# EAGLE design Ardumouse-LiION_rev3 (EAGLE 7.6.0)
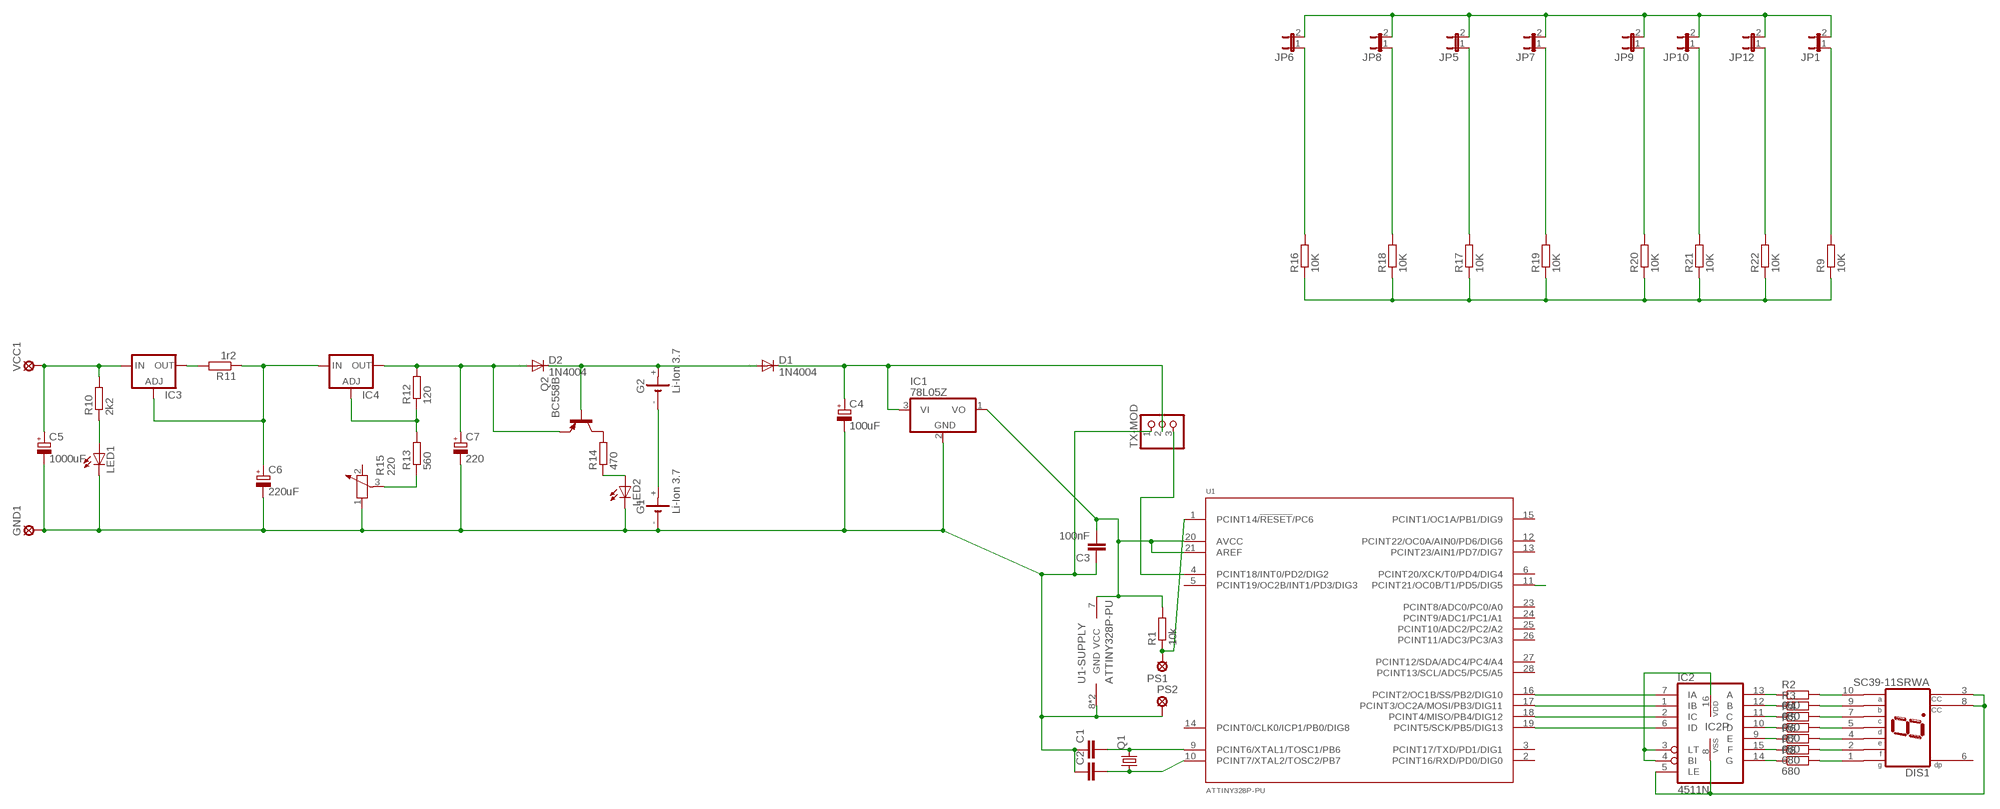
[diagram p0: schematic, sheet 1]

## Parts
C1  C2,5-3  [C2.5-3]
C2  C2,5-3  [C2.5-3]
C3  100nF  C2,5-3  [C2.5-3]
C4  100uF  CPOL-EUE3.5-8  [E3,5-8]
C5  1000uF  CPOL-EUE3.5-8  [E3,5-8]
C6  220uF  CPOL-EUE3.5-8  [E3,5-8]
C7  220  CPOL-EUE3.5-8  [E3,5-8]
D1  1N4004  [DO41-10]
D2  1N4004  [DO41-10]
DIS1  SC39-11SRWA  [HDSP-E]
G1  Li-Ion 3.7  SL-160AA/PR  [SL-160AA/PR]
G2  Li-Ion 3.7  SL-160AA/PR  [SL-160AA/PR]
GND1  LSP13  [LSP13]
IC1  78L05Z  [TO92]
IC2  4511N  [DIL16]
IC3  LM317TS  [317TS]
IC4  LM317TS  [317TS]
JP1  JP1E  [JP1]
JP5  JP1E  [JP1]
JP6  JP1E  [JP1]
JP7  JP1E  [JP1]
JP8  JP1E  [JP1]
JP9  JP1E  [JP1]
JP10  JP1E  [JP1]
JP12  JP1E  [JP1]
LED1  LED5MM  [LED5MM]
LED2  LED5MM  [LED5MM]
PS1  LSP10  [LSP10]
PS2  LSP10  [LSP10]
Q1  CRYSTALHC49S  [HC49/S]
Q2  BC558B  [TO92-EBC]
R1  10k  R-EU_0204/7  [0204/7]
R2  680  R-EU_0204/7  [0204/7]
R3  680  R-EU_0204/7  [0204/7]
R4  680  R-EU_0204/7  [0204/7]
R5  680  R-EU_0204/7  [0204/7]
R6  680  R-EU_0204/7  [0204/7]
R7  680  R-EU_0204/7  [0204/7]
R8  680  R-EU_0204/7  [0204/7]
R9  10K  R-EU_0204/7  [0204/7]
R10  2k2  R-EU_0207/7  [0207/7]
R11  1r2  R-EU_0207/7  [0207/7]
R12  120  R-EU_0207/7  [0207/7]
R13  560  R-EU_0207/7  [0207/7]
R14  470  R-EU_0207/7  [0207/7]
R15  220  POTENTIOMETER_PT-10  [PT-10]
R16  10K  R-EU_0204/7  [0204/7]
R17  10K  R-EU_0204/7  [0204/7]
R18  10K  R-EU_0204/7  [0204/7]
R19  10K  R-EU_0204/7  [0204/7]
R20  10K  R-EU_0204/7  [0204/7]
R21  10K  R-EU_0204/7  [0204/7]
R22  10K  R-EU_0204/7  [0204/7]
TX-MOD  PINHD-1X3  [1X03]
U1  ATTINY328P-PU  [DIP-28]
VCC1  LSP13  [LSP13]

## Nets
DISA: C3.2 IC1.1(VO) R1.2 U1.7(VCC) U1.20(AVCC) U1.21(AREF)
N$1: C1.2 Q1.2 U1.9(PCINT6/XTAL1/TOSC1/PB6)
N$2: C2.2 Q1.1 U1.10(PCINT7/XTAL2/TOSC2/PB7)
N$4: C4.+ D1.C IC1.3(VI) TX-MOD.2
N$6: LED1.A R10.1
N$7: TX-MOD.3 U1.4(PCINT18/INT0/PD2/DIG2)
N$10: U1.11(PCINT21/OC0B/T1/PD5/DIG5)
N$15: IC2.13(A) R2.1
N$16: PS1.MP R1.1 U1.1(PCINT14/!RESET!/PC6)
N$17: IC2.7(IA) U1.16(PCINT2/OC1B/SS/PB2/DIG10)
N$18: DIS1.3(CC) DIS1.8(CC) IC2.5(LE) IC2.8(VSS)
N$19: IC2.1(IB) U1.17(PCINT3/OC2A/MOSI/PB3/DIG11)
N$20: IC2.2(IC) U1.18(PCINT4/MISO/PB4/DIG12)
N$21: IC2.12(B) R3.1
N$22: IC2.11(C) R4.1
N$23: IC2.10(D) R5.1
N$24: IC2.9(E) R6.1
N$25: IC2.15(F) R7.1
N$26: IC2.14(G) R8.1
N$27: DIS1.10(A) R2.2
N$28: DIS1.9(B) R3.2
N$29: DIS1.7(C) R4.2
N$30: DIS1.5(D) R5.2
N$31: DIS1.4(E) R6.2
N$32: DIS1.2(F) R7.2
N$33: DIS1.1(G) R8.2
N$34: IC2.6(ID) U1.19(PCINT5/SCK/PB5/DIG13)
N$35: JP1.1 R9.2
N$36: IC2.3(LT) IC2.4(BI) IC2.16(VDD)
N$37: C5.+ IC3.3(IN) R10.2 VCC1.MP
N$39: IC3.2(OUT) R11.2
N$44: C6.+ IC3.1(ADJ) IC4.3(IN) R11.1
N$46: JP6.1 R16.2
N$47: R13.1 R15.3
N$48: IC4.1(ADJ) R12.1 R13.2
N$49: C7.+ D2.A IC4.2(OUT) Q2.E R12.2
N$50: D1.A D2.C G2.+ Q2.B
N$51: Q2.C R14.2
N$52: LED2.A R14.1
N$53: G1.+ G2.-
N$54: JP5.1 R17.2
N$55: JP8.1 R18.2
N$56: JP9.1 R20.2
N$57: JP10.1 R21.2
N$58: JP12.1 R22.2
N$59: R9.1 R16.1 R17.1 R18.1 R19.1 R20.1 R21.1 R22.1
N$60: JP1.2 JP5.2 JP6.2 JP7.2 JP8.2 JP9.2 JP10.2 JP12.2
N$61: JP7.1 R19.2
N$62: C1.1 C2.1 C3.1 C4.- C5.- C6.- C7.- G1.- GND1.MP IC1.2(GND) LED1.K(C) LED2.K(C) PS2.MP R15.1 TX-MOD.1 U1.8(GND) U1.22(GND)
Unconnected: DIS1.6(DP) R15.2 U1.2(PCINT16/RXD/PD0/DIG0) U1.3(PCINT17/TXD/PD1/DIG1) U1.5(PCINT19/OC2B/INT1/PD3/DIG3) U1.6(PCINT20/XCK/T0/PD4/DIG4) U1.12(PCINT22/OC0A/AIN0/PD6/DIG6) U1.13(PCINT23/AIN1/PD7/DIG7) U1.14(PCINT0/CLK0/ICP1/PB0/DIG8) U1.15(PCINT1/OC1A/PB1/DIG9) U1.23(PCINT8/ADC0/PC0/A0) U1.24(PCINT9/ADC1/PC1/A1) U1.25(PCINT10/ADC2/PC2/A2) U1.26(PCINT11/ADC3/PC3/A3) U1.27(PCINT12/SDA/ADC4/PC4/A4) U1.28(PCINT13/SCL/ADC5/PC5/A5)

## Library data of the parts
C1-C3 = capacitor-wima:C: CAPACITOR naming: grid - package width
C4 = resistor:CPOL-EU: POLARIZED CAPACITOR, European symbol
C5-C7 = rcl:CPOL-EU: POLARIZED CAPACITOR, European symbol
D1 D2 = diode:1N4004: DIODE general purpose rectifier, 1 A
DIS1 = display-hp:SC39-11SRWA: SINGLE DIGIT NUMERIC DISPLAY 9.9mm (0.39INCH) Source: SC39-11SRWA.pdf; OC_FARNELL: unknown; OC_NEWARK: unknown
G1 G2 = battery:SL-160AA/PR: LI BATTERY Sonnenschein
GND1 VCC1 = solpad:LSP13: SOLDER PAD drill 1.3 mm, distributor Buerklin, 12H562
IC1 = linear:78*: Positive VOLTAGE REGULATOR Source: http://cache.national.com/ds/LM/LM78L05.pdf http://www.fairchildsemi.com/ds/LM/LM7805.pdf
IC2 = 45xx:4511: BCD to 7-segment LATCH/DECODER/DRIVER
IC3 IC4 = v-reg:LM317TS: VOLTAGE REGULATOR
JP1 JP5-JP10 JP12 = jumper:JP1E: JUMPER
LED1 LED2 = led:LED: LED OSRAM: - CHIPLED LG R971, LG N971, LY N971, LG Q971, LY Q971, LO R971, LY R971 LH N974, LH R974 LS Q976, LO Q976, LY Q976 LO Q996 - Hyper CHIPLED LW Q18S LB Q993, LB Q99A, LB R99A - SideLED LS A670, LO A670, LY A670, LG A670, LP A670 LB A673, LV A673, LT A673, LW A673 LH A674 LY A675 LS A676, LA A676, LO A676, LY A676, LW A676 LS A679, LY A679, LG A679 - Hyper Micro SIDELED® LS Y876, LA Y876, LO Y876, LY Y876 LT Y87S - SmartLED LW L88C, LW L88S LB L89C, LB L89S, LG L890 LS L89K, LO L89K, LY L89K LS L896, LA L896, LO L896, LY L896 - TOPLED LS T670, LO T670, LY T670, LG T670, LP T670 LSG T670, LSP T670, LSY T670, LOP T670, LYG T670 LG T671, LOG T671, LSG T671 LB T673, LV T673, LT T673, LW T673 LH T674 LS T676, LA T676, LO T676, LY T676, LB T676, LH T676, LSB T676, LW T676 LB T67C, LV T67C, LT T67C, LS T67K, LO T67K, LY T67K, LW E67C LS E67B, LA E67B, LO E67B, LY E67B, LB E67C, LV E67C, LT E67C LW T67C LS T679, LY T679, LG T679 LS T770, LO T770, LY T770, LG T770, LP T770 LB T773, LV T773, LT T773, LW T773 LH T774 LS E675, LA E675, LY E675, LS T675 LS T776, LA T776, LO T776, LY T776, LB T776 LHGB T686 LT T68C, LB T68C - Hyper Mini TOPLED® LB M676 - Mini TOPLED Santana® LG M470 LS M47K, LO M47K, LY M47K Source: http://www.osram.convergy.de LUXEON: - LUMILED® LXK2-PW12-R00, LXK2-PW12-S00, LXK2-PW14-U00, LXK2-PW14-V00 LXK2-PM12-R00, LXK2-PM12-S00, LXK2-PM14-U00 LXK2-PE12-Q00, LXK2-PE12-R00, LXK2-PE12-S00, LXK2-PE14-T00, LXK2-PE14-U00 LXK2-PB12-K00, LXK2-PB12-L00, LXK2-PB12-M00, LXK2-PB14-N00, LXK2-PB14-P00, LXK2-PB14-Q00 LXK2-PR12-L00, LXK2-PR12-M00, LXK2-PR14-Q00, LXK2-PR14-R00 LXK2-PD12-Q00, LXK2-PD12-R00, LXK2-PD12-S00 LXK2-PH12-R00, LXK2-PH12-S00 LXK2-PL12-P00, LXK2-PL12-Q00, LXK2-PL12-R00 Source: www.luxeon.com KINGBRIGHT: KA-3528ASYC Source: www.kingbright.com
PS1 PS2 = solpad:LSP10: SOLDER PAD drill 1.0 mm, distributor Buerklin, 12H555
Q1 = crystal:CRYSTAL: CRYSTAL; OC_FARNELL: 1667008; OC_NEWARK: unknown
Q2 = transistor-pnp:BC558*: PNP Transistror
R1-R8 = resistor:R-EU_: RESISTOR, European symbol
R9-R14 R16-R22 = rcl:R-EU_: RESISTOR, European symbol
R15 = rcl:POTENTIOMETER_: Potentiometer
TX-MOD = pinhead:PINHD-1X3: PIN HEADER
U1 = volks73-Atmel:ATTINY*8P-?: ATmeag48A/PA/88A/PA/168A/PA/328/P Atmel 8-bit Microcontroller with 4/8/16/32KBytes In-System Programmable Flash Documentation Datasheet <http://www.atmel.com/images/Atmel-8271-8-bit-AVR-Microcontroller-ATmega48A-48PA-88A-88PA-168A-168PA-328-328P_datasheet_Complete.pdf> Features High Performance, Low Power AVR® 8-Bit Microcontroller Advanced RISC Architecture 131 Powerful Instructions – Most Single Clock Cycle Execution 32 x 8 General Purpose Working Registers Fully Static Operation Up to 20 MIPS Throughput at 20MHz On-chip 2-cycle Multiplier High Endurance Non-volatile Memory Segments 4/8/16/32KBytes of In-System Self Programmable Flash program memory 256/512/512/1KBytes EEPROM 512/1K/1K/2KBytes Internal SRAM Write/Erase Cycles: 10,000 Flash/100,000 EEPROM Data Retention: 20 years at 85oC/100 years at 25oC Optional boot Code Section with Independent Lock Bits In-System Programming by On-chip Boot Program True Read-While-Write Operation Atmel® QTouch® library support Capacitive touch buttons, silders and wheels QTouch and QMatrix® acquisition Up to 64 sense channels Peripheral Features Two 8-bit Timer/Counters with Separate Prescaler and Compare Mode One 16-bit Timer/Counter with Separate Prescaler, Compare Mode, and Capture Mode Real Time Counter with Separate Oscillator Six PWM Channels 8-channel 10-bit ADC in TQFP and QFN/MLF package Temperature Measurement 6-channel 10-bit ADC in PDIP Package Temperature Measurement Programmable Serial USART Master/Slave SPI Serial Interface Byte-oriented 2-wire Serial Interface (Philips I2C compatible) Programmable Watchdog Timer with Separate On-chip Oscillator On-chip Analog Comparator Interrupt and Wake-up on Pin Change Special Microcontroller Features Power-on Reset and Programmable Brown-out Detection Internal Calibrated Oscillator External and Internal Interrupt Sources Six Sleep Modes: Idle, ADC Noise Reduction, Power-save, Power-down, Standby, and Extended Standby I/O and Packages 23 Programmable I/O Lines 28-pin PDIP, 32-lead TQFP, 28-pad QFN/MLF and 32-pad QFN/MLF Operating Voltage: 1.8 - 5.5V Temperature Range: -40oC to 85oC Speed Grade: 0 - 4MHz@1.8 - 5.5V, 0 - 10MHz@2.7 - 5.5.V, 0 - 20MHz @ 4.5 - 5.5V Power Consumption at 1MHz, 1.8V, 25oC Active Mode: 0.2mA Power-down Mode: 0.1μA Power-save Mode: 0.75μA (Including 32kHz RTC); CATEGORY: Integrated Circuits (ICs); CONNECTIVITY: I²C, SPI, UART/USART; CORE_PROCESSOR: AVR; CORE_SIZE: 8-Bit; DATA_CONVERTERS: A/D 6x10b; DESCRIPTION: IC MCU 8BIT 32KB FLASH 28DIP; DOCUMENTATION_LINK: <a href="http://www.atmel.com/images/Atmel-8271-8-bit-AVR-Microcontroller-ATmega48A-48PA-88A-88PA-168A-168PA-328-328P_datasheet_Complete.pdf">Datasheet</a>; DOCUMENTATION_URL: http://www.atmel.com/images/Atmel-8271-8-bit-AVR-Microcontroller-ATmega48A-48PA-88A-88PA-168A-168PA-328-328P_datasheet_Complete.pdf; EEPROM_SIZE: 1K x 8; FAMILY: Embedded - Microcontrollers; MANUFACTURER: Atmel; NUMBER_OF_IO: 23; OPERATING_TEMPERATURE: -40°C ~ 85°C; OSCILLATOR_TYPE: Internal; PACKAGE: 28-DIP (0.300", 7.62mm); PART_NUMBER: ATMEGA328P-PU; PERIPHERALS: Brown-out Detect/Reset, POR, PWM, WDT; PROGRAM_MEMORY_SIZE: 32KB (16K x 16); PROGRAM_MEMORY_TYPE: FLASH; RAM_SIZE: 2K x 8; SERIES: AVR® ATmega; SPEED: 20MHz; SUPPLIER_DEVICE_PACKAGE: 28-PDIP; SUPPLIER_ITEM_LINK: <a href="http://www.digikey.com/product-detail/en/ATMEGA328P-PU/ATMEGA328P-PU-ND/1914589">Details</a>; SUPPLIER_ITEM_NUMBER: ATMEGA328P-PU-ND; SUPPLIER_ITEM_URL: http://www.digikey.com/product-detail/en/ATMEGA328P-PU/ATMEGA328P-PU-ND/1914589; SUPPLIER_LINK: <a href="http://www.digikey.com">Home Page</a>; SUPPLIER_NAME: Digi-Key; SUPPLIER_URL: http://www.digikey.com; VOLTAGE-SUPPLY: 1.8 V ~ 5.5 V

## Board
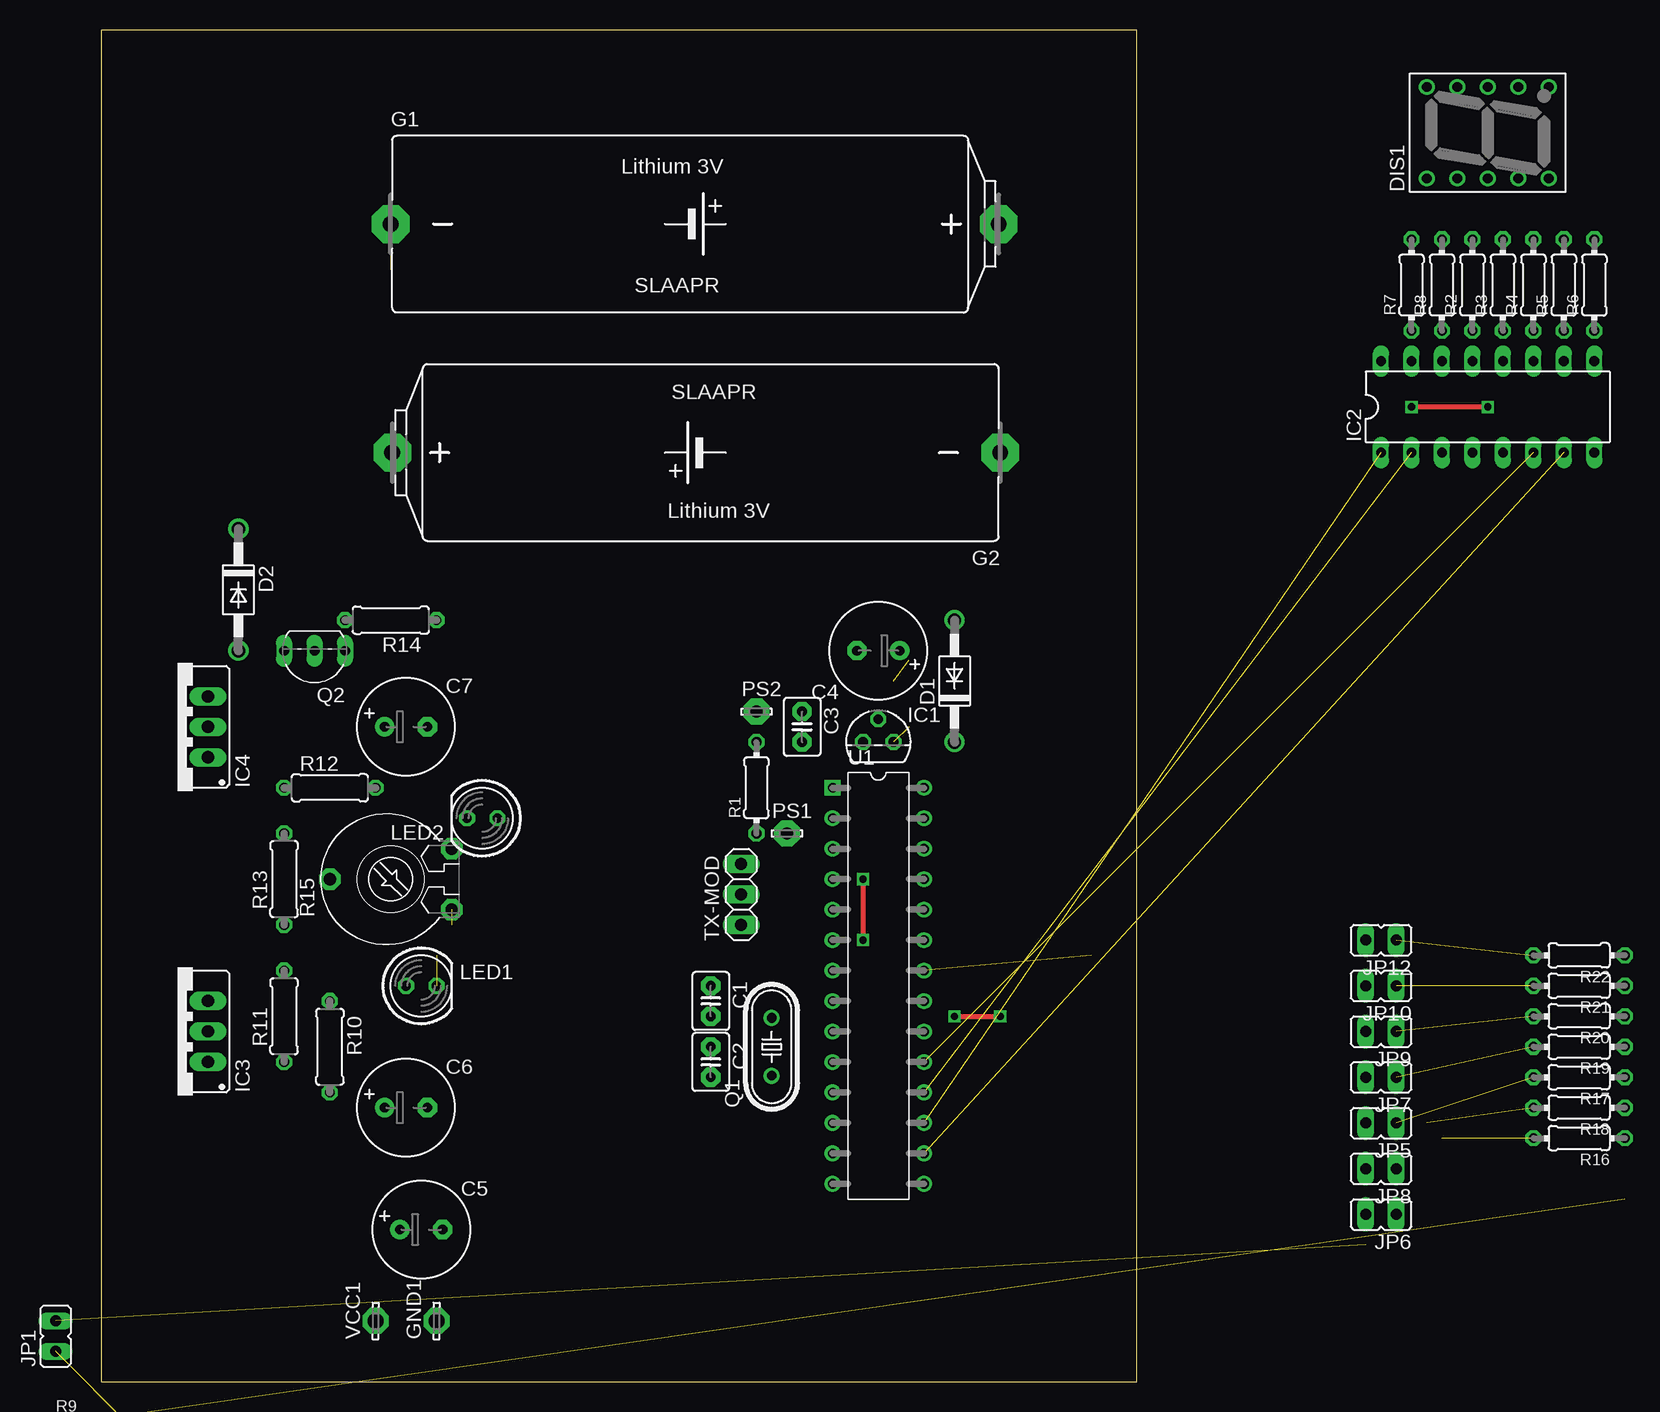
[diagram p1: board, top side]
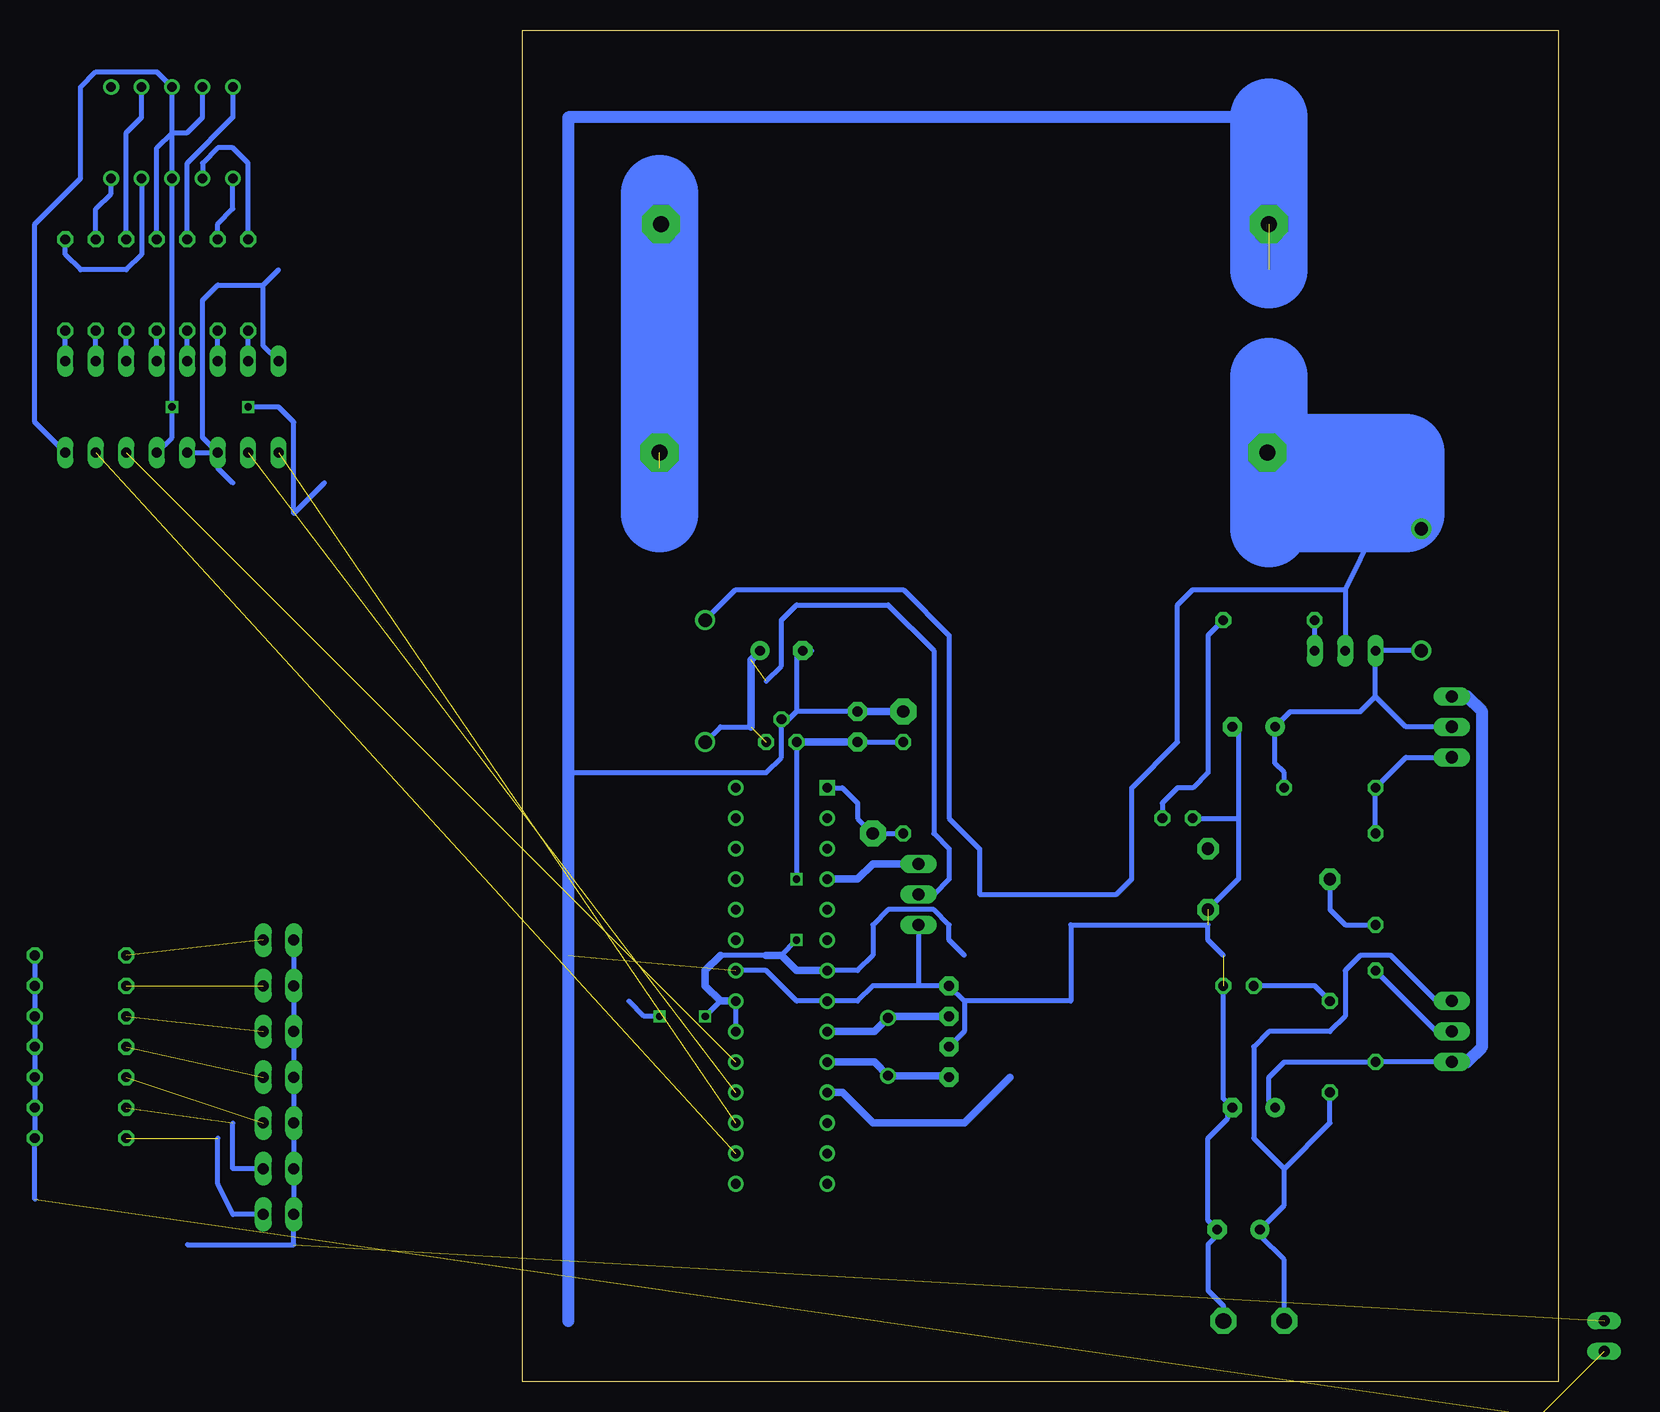
[diagram p2: board, bottom side, seen from below]

Size 86.34 x 112.7 mm. Coordinates in mm from the lower left corner, seen from the top.
Outline: 0,0 86.34,0 86.34,112.7 0,112.7 0,0
Copper layers (1*16): Top 0.035mm / dielectric 1.5mm / Bottom 0.035mm
Design rules "default": minimum track width 10mil, minimum drill 24mil, track to track 8mil, track to pad 8mil, pad to pad 8mil, via to via 8mil, smd to smd 8mil, copper to edge 40mil, drill to drill 8mil, minimum pad ring 10mil, minimum via ring 8mil, stop-mask expansion 4mil, vias tented up to drill 0mil, thermal gap 10mil

### Footprints (pad centres in the part's own frame; a part is rotated, then mirrored left to right if it is on the bottom)
C2.5-3 = drill 0.813 pad 1.6 octagon: 1 -1.27,0; 2 1.27,0
E3,5-8 = drill 0.813 pad 1.6: + -1.778,0 | drill 0.813 pad 1.6 octagon: - 1.778,0
DO41-10 = drill 1.118: A 5.08,0; C -5.08,0
HDSP-E = drill 0.813: 1 -3.81,5.08; 2 -3.81,2.54; 3 -3.81,0; 4 -3.81,-2.54; 5 -3.81,-5.08; 6 3.81,-5.08; 7 3.81,-2.54; 8 3.81,0; 9 3.81,2.54; 10 3.81,5.08
SL-160AA/PR = drill 1.321 pad 3.15 octagon: + 25.273,0; - -25.4,0
LSP13 = drill 1.321 pad 2.159 octagon: MP 0,0
TO92 = drill 0.813 octagon: 1 -1.27,0; 2 0,1.905; 3 1.27,0
DIL16 = drill 0.813 long: 1 -8.89,-3.81; 2 -6.35,-3.81; 3 -3.81,-3.81; 4 -1.27,-3.81; 5 1.27,-3.81; 6 3.81,-3.81; 7 6.35,-3.81; 8 8.89,-3.81; 9 8.89,3.81; 10 6.35,3.81; 11 3.81,3.81; 12 1.27,3.81; 13 -1.27,3.81; 14 -3.81,3.81; 15 -6.35,3.81; 16 -8.89,3.81
317TS = drill 1.016 long: 1 -2.54,-2.54; 2 0,-2.54; 3 2.54,-2.54
JP1 = drill 0.914 long: 1 0,-1.27; 2 0,1.27
LED5MM = drill 0.813 octagon: A -1.27,0; K 1.27,0
LSP10 = drill 1.016 pad 2.159 octagon: MP 0,0
HC49/S = drill 0.813: 1 -2.413,0; 2 2.413,0
TO92-EBC = drill 0.813 long: B 0,-1.27; C -2.54,-1.27; E 2.54,-1.27
0204/7 = drill 0.813 octagon: 1 -3.81,0; 2 3.81,0
0207/7 = drill 0.813 octagon: 1 -3.81,0; 2 3.81,0
PT-10 = drill 1.016 pad 1.778 octagon: 1 -2.54,-5.08; 2 2.54,-5.08; 3 0,5.08
1X03 = drill 1.016 long: 1 -2.54,0; 2 0,0; 3 2.54,0
DIP-28 = drill 0.8 square: 1 -3.81,16.51 | drill 0.8: 2 -3.81,13.97; 3 -3.81,11.43; 4 -3.81,8.89; 5 -3.81,6.35; 6 -3.81,3.81; 7 -3.81,1.27; 8 -3.81,-1.27; 9 -3.81,-3.81; 10 -3.81,-6.35; 11 -3.81,-8.89; 12 -3.81,-11.43; 13 -3.81,-13.97; 14 -3.81,-16.51; 15 3.81,-16.51; 16 3.81,-13.97; 17 3.81,-11.43; 18 3.81,-8.89; 19 3.81,-6.35; 20 3.81,-3.81; 21 3.81,-1.27; 22 3.81,1.27; 23 3.81,3.81; 24 3.81,6.35; 25 3.81,8.89; 26 3.81,11.43; 27 3.81,13.97; 28 3.81,16.51

### Placement (x,y rotation side)
C1  50.8,31.75 270 top
C2  50.8,26.67 270 top
C3  58.42,54.61 270 top
C4  64.77,60.96 180 top
C5  26.67,12.7 0 top
C6  25.4,22.86 0 top
C7  25.4,54.61 0 top
D1  71.12,58.42 90 top
D2  11.43,66.04 270 top
DIS1  115.57,104.14 90 top  (outside the outline)
G1  49.53,96.52 0 top
G2  49.53,77.47 180 top
GND1  27.94,5.08 90 top
IC1  64.77,53.34 0 top
IC2  115.57,81.28 0 top  (outside the outline)
IC3  6.35,29.21 90 top
IC4  6.35,54.61 90 top
JP1  -3.81,3.81 0 top  (outside the outline)
JP5  106.68,21.59 90 top  (outside the outline)
JP6  106.68,13.97 90 top  (outside the outline)
JP7  106.68,25.4 90 top  (outside the outline)
JP8  106.68,17.78 90 top  (outside the outline)
JP9  106.68,29.21 90 top  (outside the outline)
JP10  106.68,33.02 90 top  (outside the outline)
JP12  106.68,36.83 90 top  (outside the outline)
LED1  26.67,33.02 0 top
LED2  31.75,46.99 180 top
PS1  57.15,45.72 0 top
PS2  54.61,55.88 0 top
Q1  55.88,27.94 90 top
Q2  17.78,59.69 180 top
R1  54.61,49.53 90 top
R2  114.3,91.44 90 top  (outside the outline)
R3  116.84,91.44 90 top  (outside the outline)
R4  119.38,91.44 90 top  (outside the outline)
R5  121.92,91.44 90 top  (outside the outline)
R6  124.46,91.44 90 top  (outside the outline)
R7  109.22,91.44 90 top  (outside the outline)
R8  111.76,91.44 90 top  (outside the outline)
R9  -1.27,-3.81 0 top  (outside the outline)
R10  19.05,27.94 270 top
R11  15.24,30.48 90 top
R12  19.05,49.53 0 top
R13  15.24,41.91 90 top
R14  24.13,63.5 180 top
R15  24.13,41.91 90 top
R16  123.19,20.32 180 top  (outside the outline)
R17  123.19,25.4 180 top  (outside the outline)
R18  123.19,22.86 180 top  (outside the outline)
R19  123.19,27.94 180 top  (outside the outline)
R20  123.19,30.48 180 top  (outside the outline)
R21  123.19,33.02 180 top  (outside the outline)
R22  123.19,35.56 180 top  (outside the outline)
TX-MOD  53.34,40.64 90 top
U1  64.77,33.02 0 top
VCC1  22.86,5.08 90 top

### Tracks (layer width: path | path; a pad name or v marks a point on that pad's centre or on a via)
DISA  (via drill 0.6)
  Top 0.406: v71.12,30.48 v74.93,30.48 | v63.5,41.91 v63.5,36.83
  Bottom 0.406: v74.93,30.48 76.2,30.48 77.47,31.75 | 66.04,35.56 69.85,35.56 | C3.2 R1.2 | U1.21 U1.20 | v71.12,30.48 69.85,31.75 | IC1.1 v63.5,41.91 | 64.77,35.56 v63.5,36.83 | 49.53,35.56 50.8,36.83 50.8,38.1 52.07,39.37 55.88,39.37 57.15,38.1 57.15,35.56 58.42,34.29 U1.7
  Bottom 0.61: C3.2 IC1.1 | U1.7 63.5,34.29 64.77,35.56 66.04,35.56 | 69.85,35.56 71.12,34.29 71.12,33.02 69.85,31.75 U1.21
N$1
  Bottom 0.61: U1.9 57.02,29.21 Q1.2 55.75,30.48 C1.2
N$2
  Bottom 0.61: U1.10 57.02,26.67 Q1.1 50.93,25.53 C2.2
N$3
  Bottom 6.452: 74.93,99.06 74.93,72.39
N$4  (2 unrouted)
  Bottom 0.406: D1.C 69.85,54.61 67.31,54.61 | 66.04,58.42 64.77,59.69 64.77,63.5 63.5,64.77 55.88,64.77 52.07,60.96 52.07,45.72 50.8,44.45 50.8,41.91 52.07,40.64 TX-MOD.2
  Bottom 0.61: C4.+ 67.31,60.2 67.31,54.61
N$5
  Bottom 6.452: 24.13,83.82 24.13,77.47 | 24.13,77.47 24.13,72.39 | 24.13,72.39 24.13,71.12 | 24.13,77.47 12.7,77.47 12.7,72.39 24.13,72.39
N$6
  Bottom 0.406: R10.1 20.32,33.02 LED1.A
N$7
  Bottom 0.61: TX-MOD.3 57.15,43.18 58.42,41.91 U1.4
N$10
  Bottom 0.61: 45.72,25.4 49.53,21.59 57.15,21.59 59.69,24.13 U1.11
N$15
  Bottom 0.406: IC2.13 R2.1
N$16
  Bottom 0.406: R1.1 PS1.MP 58.42,46.99 58.42,48.26 59.69,49.53 U1.1
N$17  (1 unrouted)
N$18  (via drill 0.6)
  Top 0.406: v115.57,81.28 v109.22,81.28
  Bottom 0.406: 102.87,74.93 105.41,72.39 105.41,80.01 106.68,81.28 v109.22,81.28 | IC2.5 115.57,78.74 v115.57,81.28 DIS1.3 DIS1.8 116.84,109.22 121.92,109.22 123.19,107.95 123.19,100.33 127,96.52 127,80.01 IC2.8
N$19  (1 unrouted)
N$20  (1 unrouted)
N$21
  Bottom 0.406: IC2.12 R3.1
N$22
  Bottom 0.406: IC2.11 R4.1
N$23
  Bottom 0.406: IC2.10 R5.1
N$24
  Bottom 0.406: IC2.9 R6.1
N$25
  Bottom 0.406: IC2.15 R7.1
N$26
  Bottom 0.406: IC2.14 R8.1
N$27
  Bottom 0.406: R2.2 114.3,101.6 110.49,105.41 DIS1.10
N$28
  Bottom 0.406: R3.2 116.84,102.87 115.57,104.14 114.3,104.14 113.03,105.41 DIS1.9
N$29
  Bottom 0.406: R4.2 119.38,104.14 118.11,105.41 DIS1.7
N$30
  Bottom 0.406: R5.2 121.92,97.79 120.65,99.06 DIS1.5
N$31
  Bottom 0.406: DIS1.4 118.11,93.98 119.38,92.71 123.19,92.71 124.46,93.98 R6.2
N$32
  Bottom 0.406: R7.2 109.22,101.6 110.49,102.87 111.76,102.87 113.03,101.6 DIS1.2
N$33
  Bottom 0.406: R8.2 111.76,96.52 110.49,97.79 DIS1.1
N$34  (1 unrouted)
N$35  (1 unrouted)
N$36
  Bottom 0.406: IC2.4 IC2.3 | 110.49,74.93 111.76,76.2 IC2.3 | IC2.16 107.95,86.36 107.95,91.44 | 107.95,91.44 106.68,92.71 | IC2.3 113.03,78.74 113.03,90.17 111.76,91.44 107.95,91.44
N$37
  Bottom 0.406: 22.86,17.78 22.86,14.73 C5.+ 24.89,12.19 22.86,10.16 VCC1.MP | 22.86,17.78 19.05,21.59 R10.2 | IC3.3 10.16,31.75 13.97,35.56 16.51,35.56 17.78,34.29 17.78,30.48 19.05,29.21 24.13,29.21 25.4,27.94 25.4,20.32 22.86,17.78
N$39
  Bottom 0.406: R11.2 10.16,29.21 IC3.2
N$44
  Bottom 0.406: C6.+ 24.13,23.37 24.13,25.4 22.86,26.67 R11.1 IC3.1 7.62,26.67 | 7.62,57.15 IC4.3
  Bottom 1.016: 7.62,26.67 6.35,27.94 6.35,55.88 7.62,57.15
N$46  (1 unrouted)
  Bottom 0.406: JP6.1 110.49,13.97 111.76,16.51 111.76,20.32
N$47
  Bottom 0.406: R15.3 19.05,39.37 17.78,38.1 R13.1
N$48
  Bottom 0.406: R13.2 R12.1 12.7,52.07 IC4.1
N$49
  Bottom 0.406: R12.2 22.86,50.8 23.62,51.56 C7.+ 22.35,55.88 16.51,55.88 15.24,57.15 | 15.24,57.15 Q2.E D2.A | IC4.2 12.7,54.61 15.24,57.15
N$50
  Bottom 0.406: D2.C 15.24,71.12 | 15.24,71.12 17.78,66.04 | 17.78,66.04 Q2.B | G2.+ 15.24,77.34 15.24,71.12 | D1.A 68.58,66.04 54.61,66.04 50.8,62.23 50.8,46.99 48.26,44.45 48.26,40.64 36.83,40.64 35.56,41.91 35.56,49.53 31.75,53.34 31.75,64.77 30.48,66.04 17.78,66.04
N$51
  Bottom 0.406: Q2.C R14.2
N$52
  Bottom 0.406: R14.1 29.21,62.23 29.21,50.8 30.48,49.53 31.75,49.53 33.02,48.26 LED2.A
N$53  (1 unrouted)
  Bottom 0.406: G1.+ 74.93,96.39
  Bottom 1.676: 74.93,96.39 74.93,76.2
N$54  (1 unrouted)
N$55  (1 unrouted)
  Bottom 0.406: JP8.1 110.49,17.78 110.49,21.59
N$56  (1 unrouted)
N$57  (1 unrouted)
N$58  (1 unrouted)
N$59  (1 unrouted)
  Bottom 0.406: R22.1 R21.1 R20.1 R19.1 R17.1 R18.1 R16.1 127,15.24
N$60  (1 unrouted)
  Bottom 0.406: JP12.2 JP10.2 JP9.2 JP7.2 JP5.2 JP8.2 JP6.2 105.41,11.43 114.3,11.43
N$61  (1 unrouted)
N$62  (4 unrouted)
  Bottom 0.406: C7.- 26.67,54.1 26.67,46.99 | 26.67,46.99 26.67,41.91 R15.1 | C6.- 27.56,23.24 | 27.56,23.24 27.94,23.62 LED1.K | 27.56,23.24 27.56,21.97 29.21,20.32 29.21,13.46 C5.- 27.94,12.7 29.21,11.43 29.21,7.62 27.94,6.35 GND1.MP | LED2.K 26.67,46.99 | 27.94,35.56 29.21,36.83 29.21,38.1 40.64,38.1 40.64,31.75 49.53,31.75 | 82.55,50.8 66.04,50.8 64.77,52.07 IC1.2 64.13,55.25 63.5,55.88 | C2.1 49.53,29.21 49.53,31.75 | 49.53,31.75 C1.1 53.34,33.02 | C3.1 63.5,55.88 | 63.5,55.88 63.5,60.45 C4.- 62.23,60.96 | 53.34,33.02 57.15,33.02 58.42,31.75 U1.8 63.5,31.75 66.04,34.29 U1.22 | TX-MOD.1 53.34,33.02
  Bottom 0.61: PS2.MP C3.1
  Bottom 1.016: 24.13,105.41 82.55,105.41 82.55,50.8 82.55,35.56 82.55,5.08
  Bottom 6.452: 24.13,105.41 24.13,92.71